# EAGLE schematic gShieldSandwich (EAGLE 7.2.0)
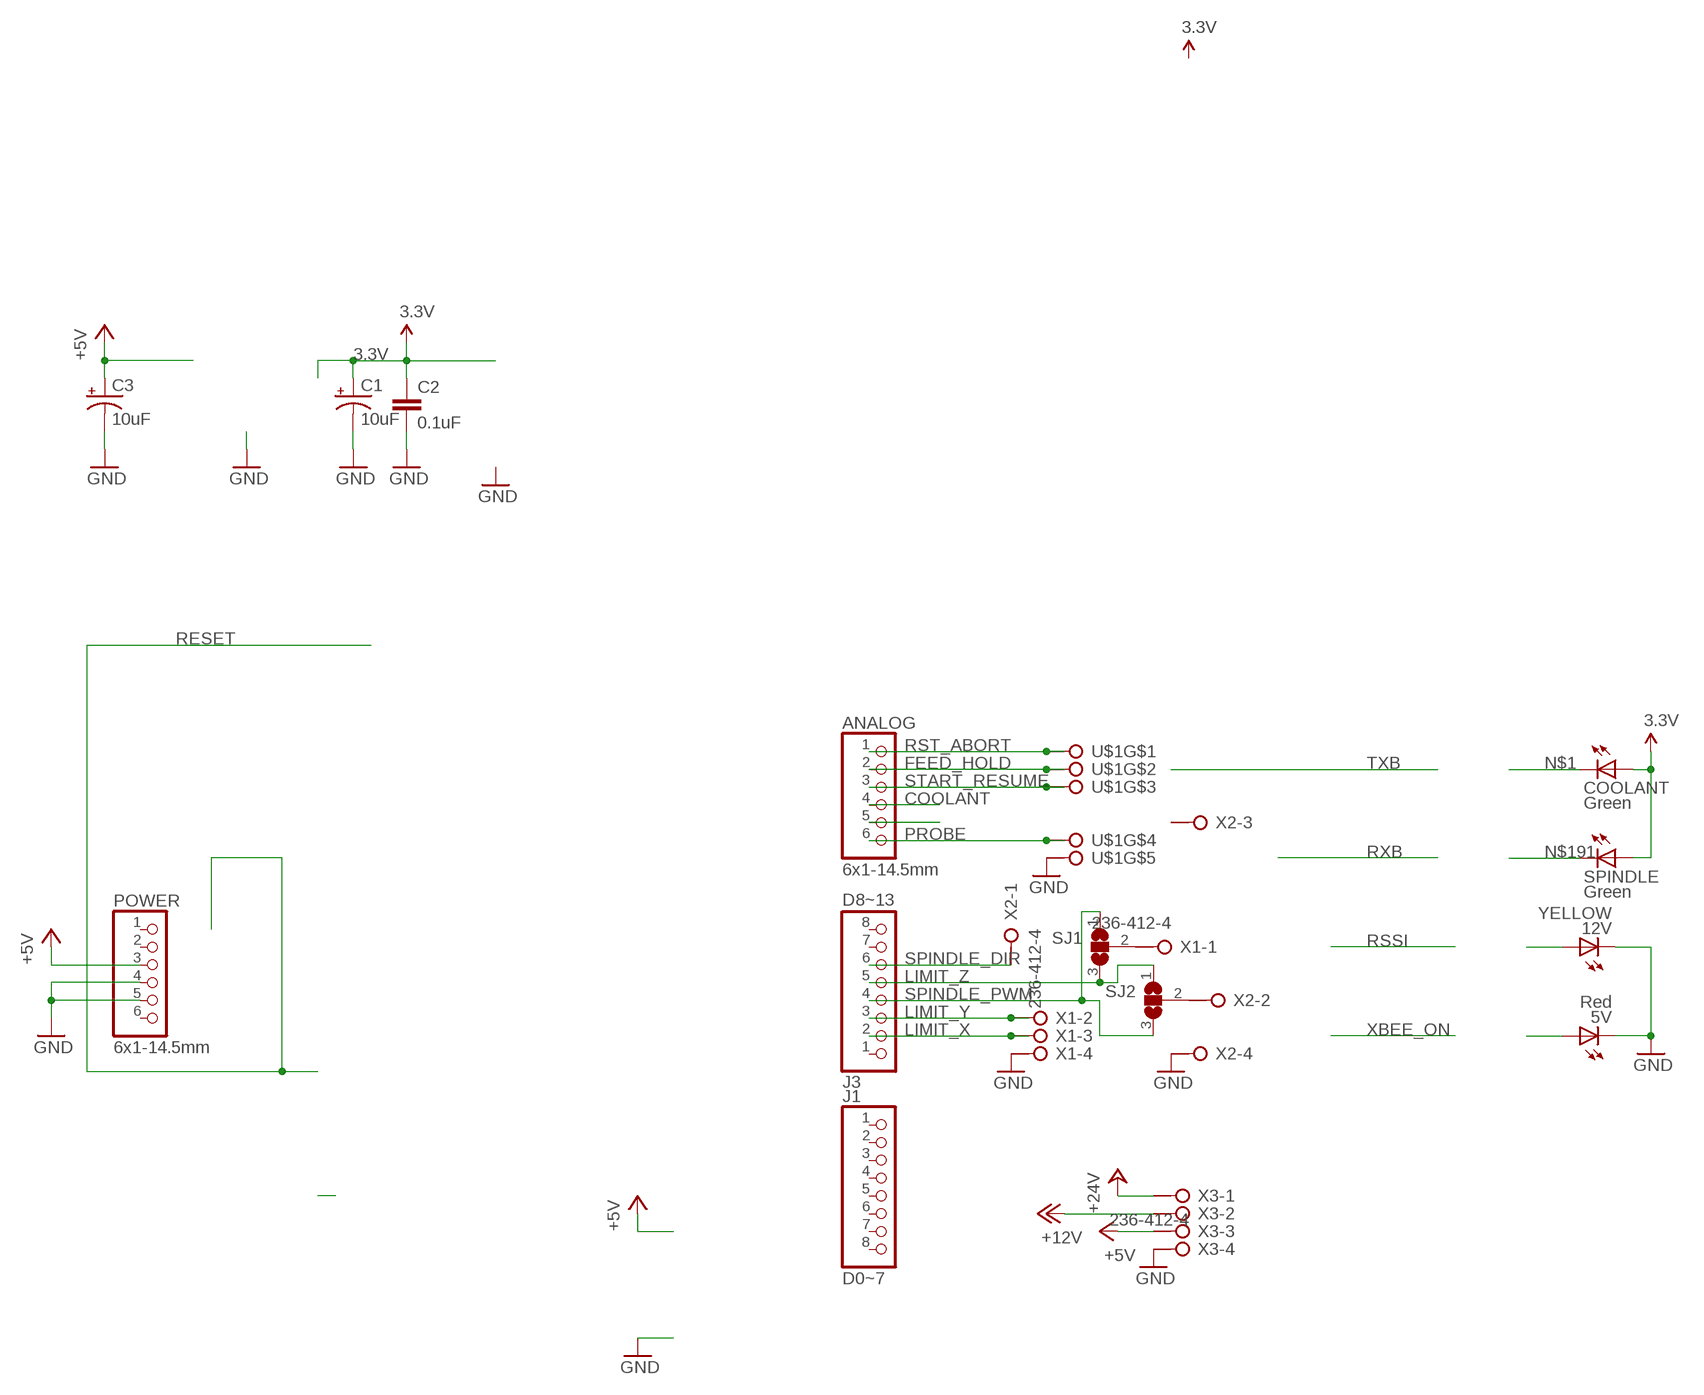
[diagram p0: schematic, sheet 1]

## Parts
5V  Red  LEDCHIP-LED0805  [CHIP-LED0805]
12V  YELLOW  LEDCHIP-LED0805  [CHIP-LED0805]
ANALOG  6x1-14.5mm  PINHD-1X6  [1X06]
C1  10uF  CAP_POL1206  [EIA3216]
C2  0.1uF  CAP0603-CAP  [0603-CAP]
C3  10uF  CAP_POL1206  [EIA3216]
COOLANT  Green  LEDCHIP-LED0805  [CHIP-LED0805]
J1  D0~7  PINHD-1X8  [1X08]
J3  D8~13  PINHD-1X8  [1X08]
POWER  6x1-14.5mm  PINHD-1X6  [1X06]
SJ1  SJ2WW  [SJ_2W]
SJ2  SJ2WW  [SJ_2W]
SPINDLE  Green  LEDCHIP-LED0805  [CHIP-LED0805]
U$1  236-412-5  [236-412-5]
X1  236-412-4  [236-412-4]
X2  236-412-4  [236-412-4]
X3  236-412-4  [236-412-4]

## Nets
3.3V: C1.A(+) C2.1 COOLANT.A SPINDLE.A
+5V: C3.A(+) POWER.3 X3.3@1(-3:KL1)
+12V: X3.2@1(-2:KL1)
+24V: X3.1@1(-1:KL1)
COOLANT: ANALOG.4
FEED_HOLD: ANALOG.2 U$1.2@1(KL1) U$1.2@2(KL2)
GND: 5V.C 12V.C C1.C(-) C2.2 C3.C(-) POWER.4 POWER.5 X3.4@1(-4:KL1)
LIMIT_X: J3.2 X1.3@1(-3:KL1) X1.3@2(-3:KL2)
LIMIT_Y: J3.3 X1.2@1(-2:KL1) X1.2@2(-2:KL2)
LIMIT_Z: J3.5 SJ1.3 SJ2.1
N$1: COOLANT.C
N$3: SJ1.2 X1.1@1(-1:KL1)
N$4: SJ2.2 X2.2@1(-2:KL1)
N$16: 12V.A
N$22: ANALOG.5
N$29: 5V.A
N$191: SPINDLE.C
PROBE: ANALOG.6 U$1.4@1(KL1) U$1.4@2(KL2)
RST_ABORT: ANALOG.1 U$1.1@1(KL1) U$1.1@2(KL2)
SPINDLE_DIR: J3.6 X2.1@1(-1:KL1)
SPINDLE_PWM: J3.4 SJ1.1 SJ2.3
START_RESUME: ANALOG.3 U$1.3@1(KL1) U$1.3@2(KL2)
Unconnected: J1.1 J1.2 J1.3 J1.4 J1.5 J1.6 J1.7 J1.8 J3.1 J3.7 J3.8 POWER.1 POWER.2 POWER.6 U$1.5@1(KL1) U$1.5@2(KL2) X1.1@2(-1:KL2) X1.4@1(-4:KL1) X1.4@2(-4:KL2) X2.1@2(-1:KL2) X2.2@2(-2:KL2) X2.3@1(-3:KL1) X2.3@2(-3:KL2) X2.4@1(-4:KL1) X2.4@2(-4:KL2) X3.1@2(-1:KL2) X3.2@2(-2:KL2) X3.3@2(-3:KL2) X3.4@2(-4:KL2)

## Library data of the parts
5V 12V COOLANT SPINDLE = led:LED: LED OSRAM: - CHIPLED LG R971, LG N971, LY N971, LG Q971, LY Q971, LO R971, LY R971 LH N974, LH R974 LS Q976, LO Q976, LY Q976 LO Q996 - Hyper CHIPLED LW Q18S LB Q993, LB Q99A, LB R99A - SideLED LS A670, LO A670, LY A670, LG A670, LP A670 LB A673, LV A673, LT A673, LW A673 LH A674 LY A675 LS A676, LA A676, LO A676, LY A676, LW A676 LS A679, LY A679, LG A679 - Hyper Micro SIDELED® LS Y876, LA Y876, LO Y876, LY Y876 LT Y87S - SmartLED LW L88C, LW L88S LB L89C, LB L89S, LG L890 LS L89K, LO L89K, LY L89K LS L896, LA L896, LO L896, LY L896 - TOPLED LS T670, LO T670, LY T670, LG T670, LP T670 LSG T670, LSP T670, LSY T670, LOP T670, LYG T670 LG T671, LOG T671, LSG T671 LB T673, LV T673, LT T673, LW T673 LH T674 LS T676, LA T676, LO T676, LY T676, LB T676, LH T676, LSB T676, LW T676 LB T67C, LV T67C, LT T67C, LS T67K, LO T67K, LY T67K, LW E67C LS E67B, LA E67B, LO E67B, LY E67B, LB E67C, LV E67C, LT E67C LW T67C LS T679, LY T679, LG T679 LS T770, LO T770, LY T770, LG T770, LP T770 LB T773, LV T773, LT T773, LW T773 LH T774 LS E675, LA E675, LY E675, LS T675 LS T776, LA T776, LO T776, LY T776, LB T776 LHGB T686 LT T68C, LB T68C - Hyper Mini TOPLED® LB M676 - Mini TOPLED Santana® LG M470 LS M47K, LO M47K, LY M47K Source: http://www.osram.convergy.de LUXEON: - LUMILED® LXK2-PW12-R00, LXK2-PW12-S00, LXK2-PW14-U00, LXK2-PW14-V00 LXK2-PM12-R00, LXK2-PM12-S00, LXK2-PM14-U00 LXK2-PE12-Q00, LXK2-PE12-R00, LXK2-PE12-S00, LXK2-PE14-T00, LXK2-PE14-U00 LXK2-PB12-K00, LXK2-PB12-L00, LXK2-PB12-M00, LXK2-PB14-N00, LXK2-PB14-P00, LXK2-PB14-Q00 LXK2-PR12-L00, LXK2-PR12-M00, LXK2-PR14-Q00, LXK2-PR14-R00 LXK2-PD12-Q00, LXK2-PD12-R00, LXK2-PD12-S00 LXK2-PH12-R00, LXK2-PH12-S00 LXK2-PL12-P00, LXK2-PL12-Q00, LXK2-PL12-R00 Source: www.luxeon.com KINGBRIGHT: KA-3528ASYC Source: www.kingbright.com
ANALOG POWER = pinhead:PINHD-1X6: PIN HEADER
C1 C3 = SparkFun:CAP_POL: Capacitor Polarized These are standard SMD and PTH capacitors. Normally 10uF, 47uF, and 100uF in electrolytic and tantalum varieties. Always verify the external diameter of the through hole cap, it varies with capacity, voltage, and manufacturer. The EIA devices should be standard.
C2 = SparkFun:CAP: Capacitor Standard 0603 ceramic capacitor, and 0.1" leaded capacitor.
J1 J3 = pinhead:PINHD-1X8: PIN HEADER
SJ1 SJ2 = jumper:SJ2W: SMD solder JUMPER
U$1 = connector:236-412-5: Terminal Strips 2.5 mm2/AWG 12, Series 236, Pin Spacings 5/5.08 mm Source: Data sheet <http://www.farnell.com/datasheets/63479.pdf>
X1-X3 = connector:236-412-4: Terminal Strips 2.5 mm2/AWG 12, Series 236, Pin Spacings 5/5.08 mm Source: Data sheet <http://www.farnell.com/datasheets/63479.pdf>; MF: Wago Corporation; MPN: 0236-0412; OC_FARNELL: 1283531; OC_NEWARK: 79K2064

## Net classes
0 default: width 0.203 mm, drill 0.559 mm, clearance 0.203 mm
2 gnd: width 0.203 mm, drill 0.559 mm, clearance 0.203 mm